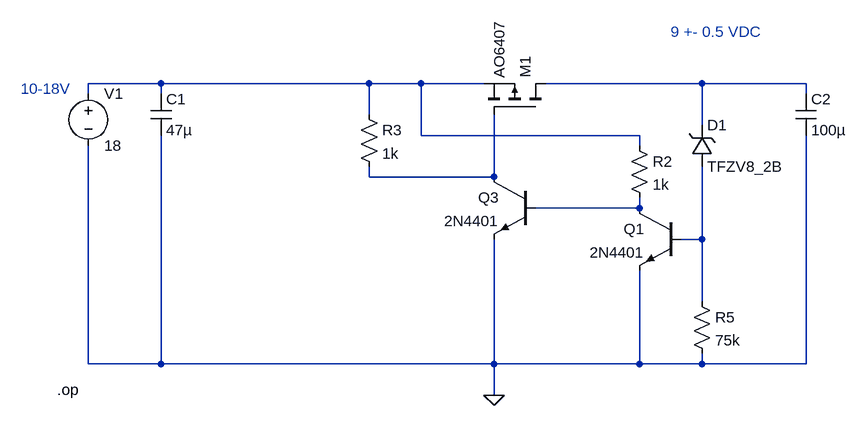
[diagram p0: schematic LDO.asc]
LDO.asc, the LTspice schematic file:
Version 4
SHEET 1 1240 680
WIRE -384 128 -496 128
WIRE -64 128 -384 128
WIRE 16 128 -64 128
WIRE 112 128 16 128
WIRE 448 128 208 128
WIRE 608 128 448 128
WIRE -496 144 -496 128
WIRE -384 144 -384 128
WIRE 608 144 608 128
WIRE -64 176 -64 128
WIRE 448 192 448 128
WIRE 16 208 16 128
WIRE 352 208 16 208
WIRE 352 224 352 208
WIRE -64 272 -64 256
WIRE 128 272 128 176
WIRE 128 272 -64 272
WIRE 352 320 352 304
WIRE 352 320 192 320
WIRE 448 368 448 256
WIRE 448 368 416 368
WIRE 448 464 448 368
WIRE -496 560 -496 224
WIRE -384 560 -384 208
WIRE -384 560 -496 560
WIRE 128 560 128 368
WIRE 128 560 -384 560
WIRE 352 560 352 416
WIRE 352 560 128 560
WIRE 448 560 448 544
WIRE 448 560 352 560
WIRE 608 560 608 208
WIRE 608 560 448 560
WIRE 128 608 128 560
FLAG 128 608 0
DATAFLAG -464 128 "I(V1)"
DATAFLAG 400 128 ""
DATAFLAG 448 352 ""
SYMBOL pmos 208 176 M270
SYMATTR InstName M1
SYMATTR Value AO6407
SYMBOL voltage -496 128 R0
WINDOW 123 0 0 Left 0
WINDOW 39 0 0 Left 0
SYMATTR InstName V1
SYMATTR Value 18
SYMBOL cap -400 144 R0
SYMATTR InstName C1
SYMATTR Value 47µ
SYMBOL cap 592 144 R0
SYMATTR InstName C2
SYMATTR Value 100µ
SYMBOL res 432 448 R0
SYMATTR InstName R5
SYMATTR Value 75k
SYMBOL npn 192 272 M0
SYMATTR InstName Q3
SYMATTR Value 2N4401
SYMBOL npn 416 320 M0
SYMATTR InstName Q1
SYMATTR Value 2N4401
SYMBOL zener 432 256 M180
WINDOW 0 24 64 Left 2
WINDOW 3 24 0 Left 2
SYMATTR InstName D1
SYMATTR Value TFZV8_2B
SYMATTR Description Diode
SYMATTR Type diode
SYMBOL res -80 160 R0
SYMATTR InstName R3
SYMATTR Value 1k
SYMBOL res 336 208 R0
SYMATTR InstName R2
SYMATTR Value 1k
TEXT -600 136 Left 2 ;10-18V
TEXT 400 48 Left 2 ;9 +- 0.5 VDC
TEXT -544 600 Left 2 !.op

The netlist it stands for:
* LDO.asc
M1 N002 N003 N001 N001 AO6407
V1 N001 0 18
C1 N001 0 47µ
C2 N002 0 100µ
R5 N005 0 75k
Q3 N003 N004 0 0 2N4401
Q1 N004 N005 0 0 2N4401
D1 N005 N002 TFZV8_2B
R3 N001 N003 1k
R2 N001 N004 1k
.model D D
.lib standard.dio
.model NPN NPN
.model PNP PNP
.lib standard.bjt
.model NMOS NMOS
.model PMOS PMOS
.lib standard.mos
* 10-18V
* 9 +- 0.5 VDC
.op
.backanno
.end